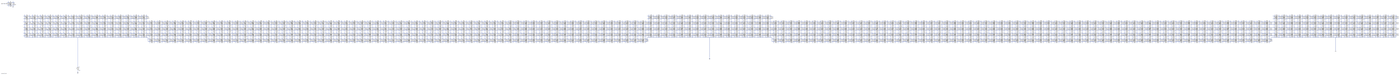
[diagram p0: schematic resistiveReactance.asc, whole sheet]
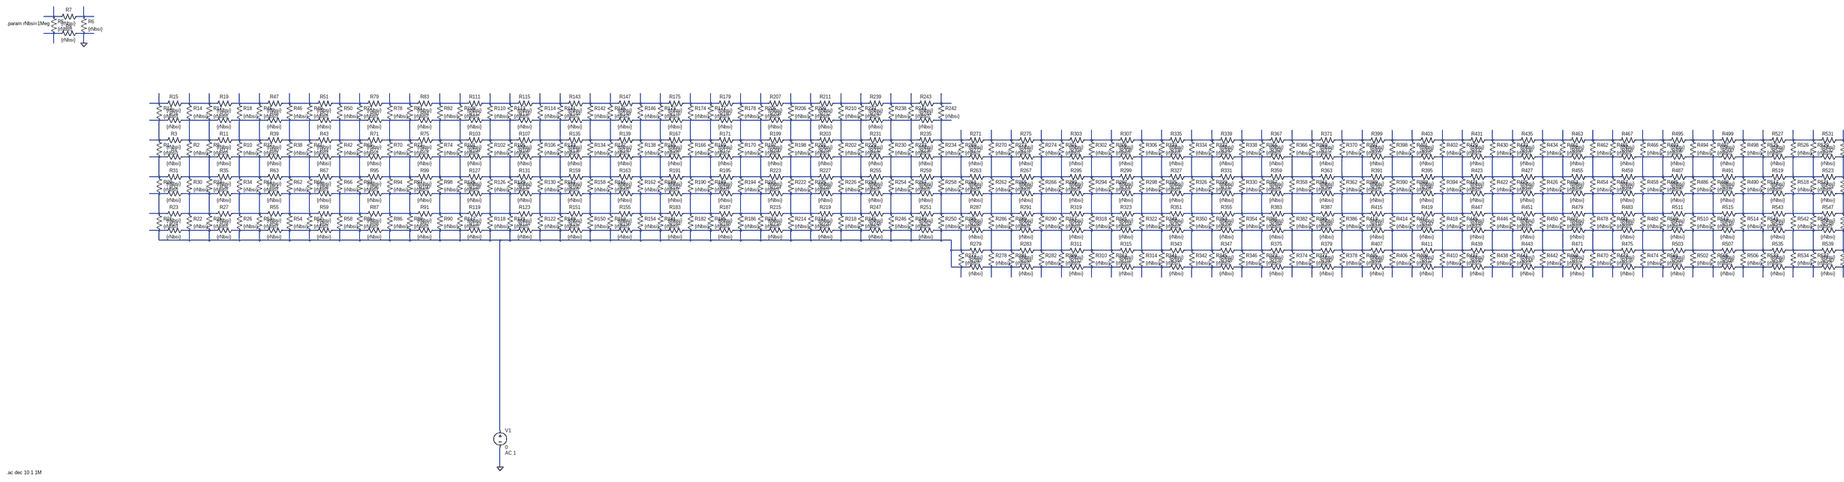
[diagram p1: schematic resistiveReactance.asc, part, row 1 of 1, column 1 of 5]
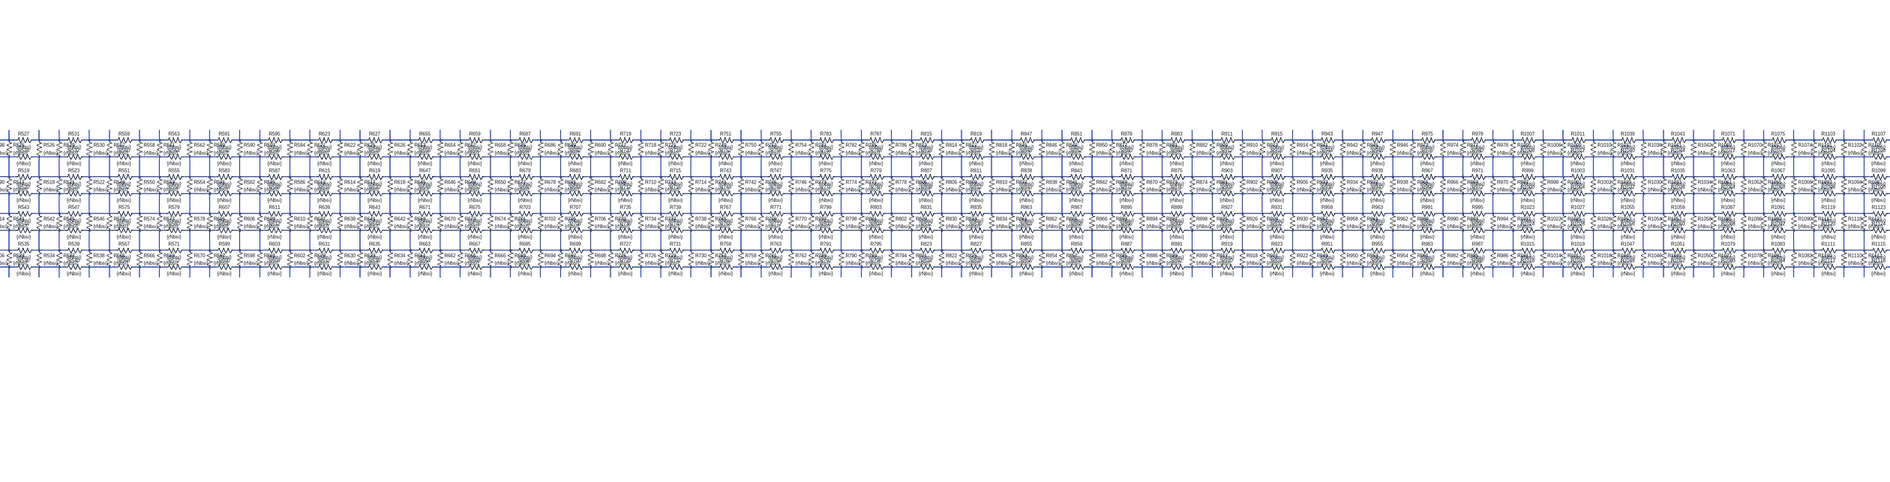
[diagram p2: schematic resistiveReactance.asc, part, row 1 of 1, column 2 of 5]
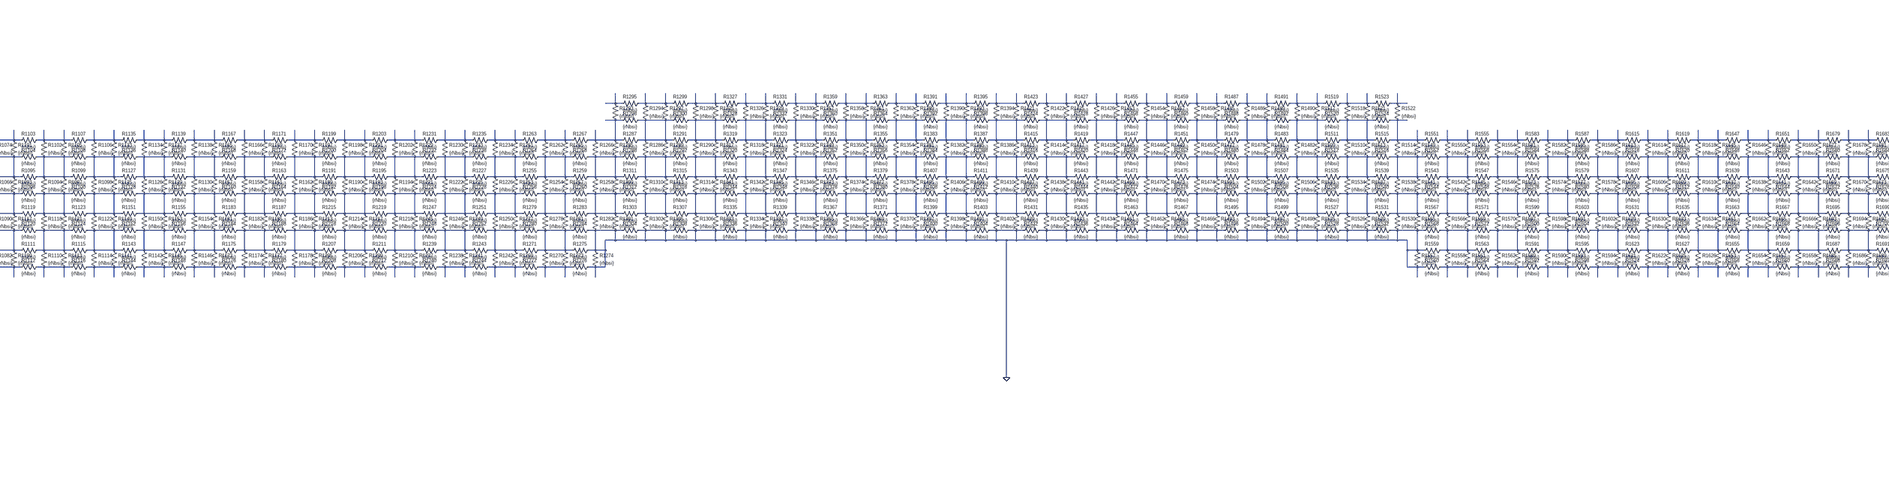
[diagram p3: schematic resistiveReactance.asc, part, row 1 of 1, column 3 of 5]
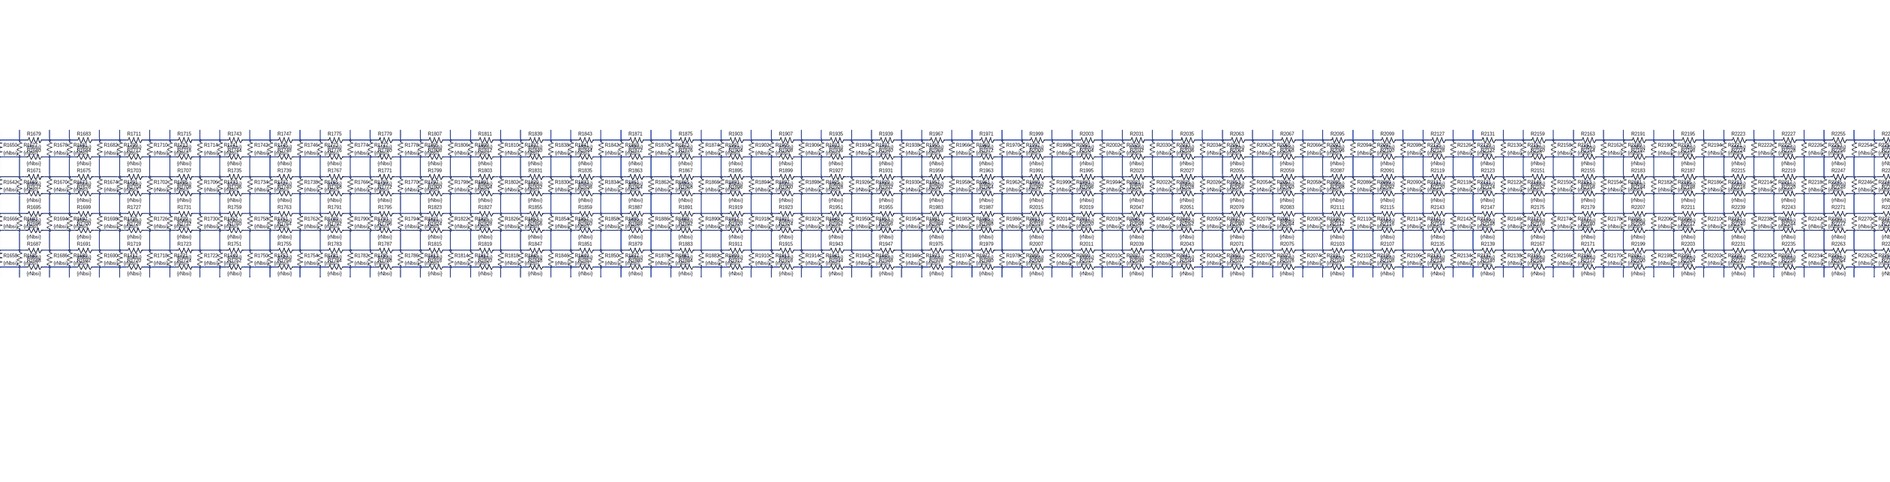
[diagram p4: schematic resistiveReactance.asc, part, row 1 of 1, column 4 of 5]
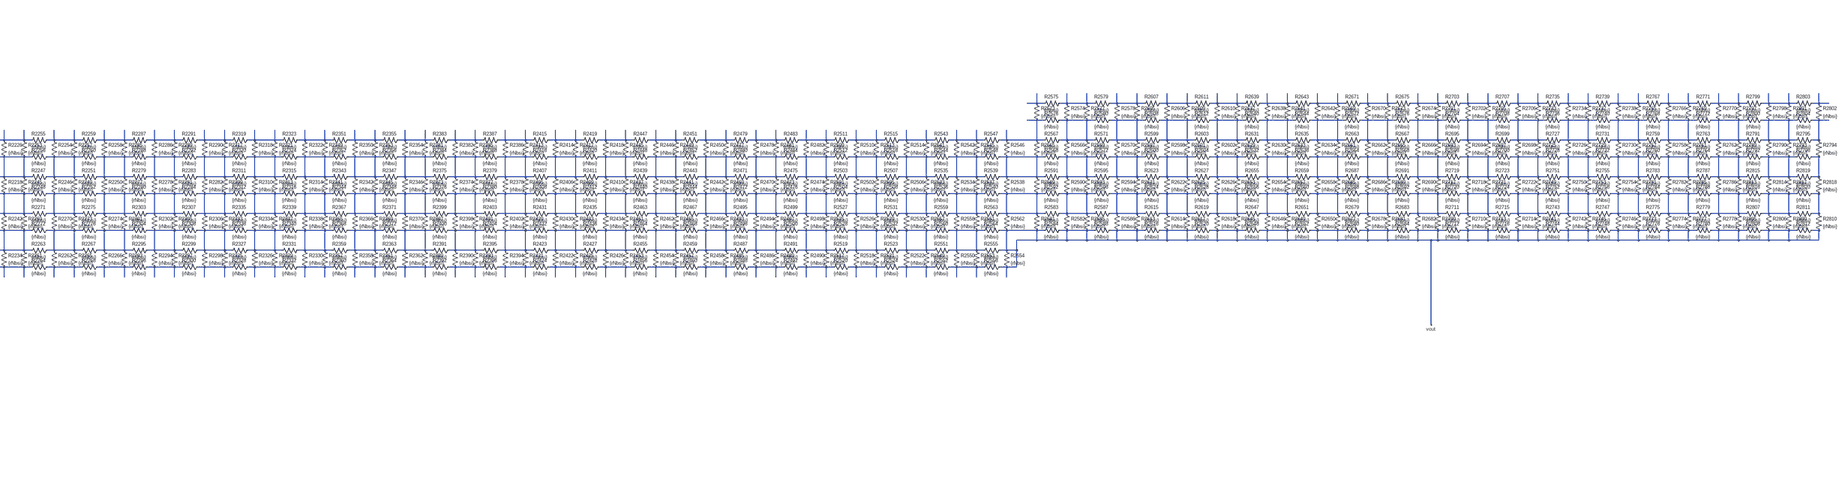
[diagram p5: schematic resistiveReactance.asc, part, row 1 of 1, column 5 of 5]
* resistiveReactance.asc
R5 N001 N003 {rNbsi}
R6 N002 0 {rNbsi}
R7 N002 N001 {rNbsi}
R8 0 N003 {rNbsi}
R1 N055 N232 {rNbsi}
R2 N056 N233 {rNbsi}
R3 N056 N055 {rNbsi}
R4 N233 N232 {rNbsi}
R9 N056 N233 {rNbsi}
R10 N057 N234 {rNbsi}
R11 N057 N056 {rNbsi}
R12 N234 N233 {rNbsi}
R13 N004 N055 {rNbsi}
R14 N005 N056 {rNbsi}
R15 N005 N004 {rNbsi}
R16 N056 N055 {rNbsi}
R17 N005 N056 {rNbsi}
R18 N006 N057 {rNbsi}
R19 N006 N005 {rNbsi}
R20 N057 N056 {rNbsi}
R21 N409 N586 {rNbsi}
R22 N410 N586 {rNbsi}
R23 N410 N409 {rNbsi}
R24 N586 N586 {rNbsi}
R25 N410 N586 {rNbsi}
R26 N411 N586 {rNbsi}
R27 N411 N410 {rNbsi}
R28 N586 N586 {rNbsi}
R29 N232 N409 {rNbsi}
R30 N233 N410 {rNbsi}
R31 N233 N232 {rNbsi}
R32 N410 N409 {rNbsi}
R33 N233 N410 {rNbsi}
R34 N234 N411 {rNbsi}
R35 N234 N233 {rNbsi}
R36 N411 N410 {rNbsi}
R37 N057 N234 {rNbsi}
R38 N058 N235 {rNbsi}
R39 N058 N057 {rNbsi}
R40 N235 N234 {rNbsi}
R41 N058 N235 {rNbsi}
R42 N059 N236 {rNbsi}
R43 N059 N058 {rNbsi}
R44 N236 N235 {rNbsi}
R45 N006 N057 {rNbsi}
R46 N007 N058 {rNbsi}
R47 N007 N006 {rNbsi}
R48 N058 N057 {rNbsi}
R49 N007 N058 {rNbsi}
R50 N008 N059 {rNbsi}
R51 N008 N007 {rNbsi}
R52 N059 N058 {rNbsi}
R53 N411 N586 {rNbsi}
R54 N412 N586 {rNbsi}
R55 N412 N411 {rNbsi}
R56 N586 N586 {rNbsi}
R57 N412 N586 {rNbsi}
R58 N413 N586 {rNbsi}
R59 N413 N412 {rNbsi}
R60 N586 N586 {rNbsi}
R61 N234 N411 {rNbsi}
R62 N235 N412 {rNbsi}
R63 N235 N234 {rNbsi}
R64 N412 N411 {rNbsi}
R65 N235 N412 {rNbsi}
R66 N236 N413 {rNbsi}
R67 N236 N235 {rNbsi}
R68 N413 N412 {rNbsi}
R69 N059 N236 {rNbsi}
R70 N060 N237 {rNbsi}
R71 N060 N059 {rNbsi}
R72 N237 N236 {rNbsi}
R73 N060 N237 {rNbsi}
R74 N061 N238 {rNbsi}
R75 N061 N060 {rNbsi}
R76 N238 N237 {rNbsi}
R77 N008 N059 {rNbsi}
R78 N009 N060 {rNbsi}
R79 N009 N008 {rNbsi}
R80 N060 N059 {rNbsi}
R81 N009 N060 {rNbsi}
R82 N010 N061 {rNbsi}
R83 N010 N009 {rNbsi}
R84 N061 N060 {rNbsi}
R85 N413 N586 {rNbsi}
R86 N414 N586 {rNbsi}
R87 N414 N413 {rNbsi}
R88 N586 N586 {rNbsi}
R89 N414 N586 {rNbsi}
R90 N415 N586 {rNbsi}
R91 N415 N414 {rNbsi}
R92 N586 N586 {rNbsi}
R93 N236 N413 {rNbsi}
R94 N237 N414 {rNbsi}
R95 N237 N236 {rNbsi}
R96 N414 N413 {rNbsi}
R97 N237 N414 {rNbsi}
R98 N238 N415 {rNbsi}
R99 N238 N237 {rNbsi}
R100 N415 N414 {rNbsi}
R101 N061 N238 {rNbsi}
R102 N062 N239 {rNbsi}
R103 N062 N061 {rNbsi}
R104 N239 N238 {rNbsi}
R105 N062 N239 {rNbsi}
R106 N063 N240 {rNbsi}
R107 N063 N062 {rNbsi}
R108 N240 N239 {rNbsi}
R109 N010 N061 {rNbsi}
R110 N011 N062 {rNbsi}
R111 N011 N010 {rNbsi}
R112 N062 N061 {rNbsi}
R113 N011 N062 {rNbsi}
R114 N012 N063 {rNbsi}
R115 N012 N011 {rNbsi}
R116 N063 N062 {rNbsi}
R117 N415 N586 {rNbsi}
R118 N416 N586 {rNbsi}
R119 N416 N415 {rNbsi}
R120 N586 N586 {rNbsi}
R121 N416 N586 {rNbsi}
R122 N417 N586 {rNbsi}
R123 N417 N416 {rNbsi}
R124 N586 N586 {rNbsi}
R125 N238 N415 {rNbsi}
R126 N239 N416 {rNbsi}
R127 N239 N238 {rNbsi}
R128 N416 N415 {rNbsi}
R129 N239 N416 {rNbsi}
R130 N240 N417 {rNbsi}
R131 N240 N239 {rNbsi}
R132 N417 N416 {rNbsi}
R133 N063 N240 {rNbsi}
R134 N064 N241 {rNbsi}
R135 N064 N063 {rNbsi}
R136 N241 N240 {rNbsi}
R137 N064 N241 {rNbsi}
R138 N065 N242 {rNbsi}
R139 N065 N064 {rNbsi}
R140 N242 N241 {rNbsi}
R141 N012 N063 {rNbsi}
R142 N013 N064 {rNbsi}
R143 N013 N012 {rNbsi}
R144 N064 N063 {rNbsi}
R145 N013 N064 {rNbsi}
R146 N014 N065 {rNbsi}
R147 N014 N013 {rNbsi}
R148 N065 N064 {rNbsi}
R149 N417 N586 {rNbsi}
R150 N418 N586 {rNbsi}
R151 N418 N417 {rNbsi}
R152 N586 N586 {rNbsi}
R153 N418 N586 {rNbsi}
R154 N419 N586 {rNbsi}
R155 N419 N418 {rNbsi}
R156 N586 N586 {rNbsi}
R157 N240 N417 {rNbsi}
R158 N241 N418 {rNbsi}
R159 N241 N240 {rNbsi}
R160 N418 N417 {rNbsi}
R161 N241 N418 {rNbsi}
R162 N242 N419 {rNbsi}
R163 N242 N241 {rNbsi}
R164 N419 N418 {rNbsi}
R165 N065 N242 {rNbsi}
R166 N066 N243 {rNbsi}
R167 N066 N065 {rNbsi}
R168 N243 N242 {rNbsi}
R169 N066 N243 {rNbsi}
R170 N067 N244 {rNbsi}
R171 N067 N066 {rNbsi}
R172 N244 N243 {rNbsi}
R173 N014 N065 {rNbsi}
R174 N015 N066 {rNbsi}
R175 N015 N014 {rNbsi}
R176 N066 N065 {rNbsi}
R177 N015 N066 {rNbsi}
R178 N016 N067 {rNbsi}
R179 N016 N015 {rNbsi}
R180 N067 N066 {rNbsi}
R181 N419 N586 {rNbsi}
R182 N420 N586 {rNbsi}
R183 N420 N419 {rNbsi}
R184 N586 N586 {rNbsi}
R185 N420 N586 {rNbsi}
R186 N421 N586 {rNbsi}
R187 N421 N420 {rNbsi}
R188 N586 N586 {rNbsi}
R189 N242 N419 {rNbsi}
R190 N243 N420 {rNbsi}
R191 N243 N242 {rNbsi}
R192 N420 N419 {rNbsi}
R193 N243 N420 {rNbsi}
R194 N244 N421 {rNbsi}
R195 N244 N243 {rNbsi}
R196 N421 N420 {rNbsi}
R197 N067 N244 {rNbsi}
R198 N068 N245 {rNbsi}
R199 N068 N067 {rNbsi}
R200 N245 N244 {rNbsi}
R201 N068 N245 {rNbsi}
R202 N069 N246 {rNbsi}
R203 N069 N068 {rNbsi}
R204 N246 N245 {rNbsi}
R205 N016 N067 {rNbsi}
R206 N017 N068 {rNbsi}
R207 N017 N016 {rNbsi}
R208 N068 N067 {rNbsi}
R209 N017 N068 {rNbsi}
R210 N018 N069 {rNbsi}
R211 N018 N017 {rNbsi}
R212 N069 N068 {rNbsi}
R213 N421 N586 {rNbsi}
R214 N422 N586 {rNbsi}
R215 N422 N421 {rNbsi}
R216 N586 N586 {rNbsi}
R217 N422 N586 {rNbsi}
R218 N423 N586 {rNbsi}
R219 N423 N422 {rNbsi}
R220 N586 N586 {rNbsi}
R221 N244 N421 {rNbsi}
R222 N245 N422 {rNbsi}
R223 N245 N244 {rNbsi}
R224 N422 N421 {rNbsi}
R225 N245 N422 {rNbsi}
R226 N246 N423 {rNbsi}
R227 N246 N245 {rNbsi}
R228 N423 N422 {rNbsi}
R229 N069 N246 {rNbsi}
R230 N070 N247 {rNbsi}
R231 N070 N069 {rNbsi}
R232 N247 N246 {rNbsi}
R233 N070 N247 {rNbsi}
R234 N071 N248 {rNbsi}
R235 N071 N070 {rNbsi}
R236 N248 N247 {rNbsi}
R237 N018 N069 {rNbsi}
R238 N019 N070 {rNbsi}
R239 N019 N018 {rNbsi}
R240 N070 N069 {rNbsi}
R241 N019 N070 {rNbsi}
R242 N020 N071 {rNbsi}
R243 N020 N019 {rNbsi}
R244 N071 N070 {rNbsi}
R245 N423 N586 {rNbsi}
R246 N424 N586 {rNbsi}
R247 N424 N423 {rNbsi}
R248 N586 N586 {rNbsi}
R249 N424 N586 {rNbsi}
R250 N425 N586 {rNbsi}
R251 N425 N424 {rNbsi}
R252 N586 N586 {rNbsi}
R253 N246 N423 {rNbsi}
R254 N247 N424 {rNbsi}
R255 N247 N246 {rNbsi}
R256 N424 N423 {rNbsi}
R257 N247 N424 {rNbsi}
R258 N248 N425 {rNbsi}
R259 N248 N247 {rNbsi}
R260 N425 N424 {rNbsi}
R261 N248 N425 {rNbsi}
R262 N249 N426 {rNbsi}
R263 N249 N248 {rNbsi}
R264 N426 N425 {rNbsi}
R265 N249 N426 {rNbsi}
R266 N250 N427 {rNbsi}
R267 N250 N249 {rNbsi}
R268 N427 N426 {rNbsi}
R269 N071 N248 {rNbsi}
R270 N106 N249 {rNbsi}
R271 N106 N071 {rNbsi}
R272 N249 N248 {rNbsi}
R273 N106 N249 {rNbsi}
R274 N107 N250 {rNbsi}
R275 N107 N106 {rNbsi}
R276 N250 N249 {rNbsi}
R277 N586 N586 {rNbsi}
R278 N587 N713 {rNbsi}
R279 N587 N586 {rNbsi}
R280 N713 N586 {rNbsi}
R281 N587 N713 {rNbsi}
R282 N588 N714 {rNbsi}
R283 N588 N587 {rNbsi}
R284 N714 N713 {rNbsi}
R285 N425 N586 {rNbsi}
R286 N426 N587 {rNbsi}
R287 N426 N425 {rNbsi}
R288 N587 N586 {rNbsi}
R289 N426 N587 {rNbsi}
R290 N427 N588 {rNbsi}
R291 N427 N426 {rNbsi}
R292 N588 N587 {rNbsi}
R293 N250 N427 {rNbsi}
R294 N251 N428 {rNbsi}
R295 N251 N250 {rNbsi}
R296 N428 N427 {rNbsi}
R297 N251 N428 {rNbsi}
R298 N252 N429 {rNbsi}
R299 N252 N251 {rNbsi}
R300 N429 N428 {rNbsi}
R301 N107 N250 {rNbsi}
R302 N108 N251 {rNbsi}
R303 N108 N107 {rNbsi}
R304 N251 N250 {rNbsi}
R305 N108 N251 {rNbsi}
R306 N109 N252 {rNbsi}
R307 N109 N108 {rNbsi}
R308 N252 N251 {rNbsi}
R309 N588 N714 {rNbsi}
R310 N589 N715 {rNbsi}
R311 N589 N588 {rNbsi}
R312 N715 N714 {rNbsi}
R313 N589 N715 {rNbsi}
R314 N590 N716 {rNbsi}
R315 N590 N589 {rNbsi}
R316 N716 N715 {rNbsi}
R317 N427 N588 {rNbsi}
R318 N428 N589 {rNbsi}
R319 N428 N427 {rNbsi}
R320 N589 N588 {rNbsi}
R321 N428 N589 {rNbsi}
R322 N429 N590 {rNbsi}
R323 N429 N428 {rNbsi}
R324 N590 N589 {rNbsi}
R325 N252 N429 {rNbsi}
R326 N253 N430 {rNbsi}
R327 N253 N252 {rNbsi}
R328 N430 N429 {rNbsi}
R329 N253 N430 {rNbsi}
R330 N254 N431 {rNbsi}
R331 N254 N253 {rNbsi}
R332 N431 N430 {rNbsi}
R333 N109 N252 {rNbsi}
R334 N110 N253 {rNbsi}
R335 N110 N109 {rNbsi}
R336 N253 N252 {rNbsi}
R337 N110 N253 {rNbsi}
R338 N111 N254 {rNbsi}
R339 N111 N110 {rNbsi}
R340 N254 N253 {rNbsi}
R341 N590 N716 {rNbsi}
R342 N591 N717 {rNbsi}
R343 N591 N590 {rNbsi}
R344 N717 N716 {rNbsi}
R345 N591 N717 {rNbsi}
R346 N592 N718 {rNbsi}
R347 N592 N591 {rNbsi}
R348 N718 N717 {rNbsi}
R349 N429 N590 {rNbsi}
R350 N430 N591 {rNbsi}
R351 N430 N429 {rNbsi}
R352 N591 N590 {rNbsi}
R353 N430 N591 {rNbsi}
R354 N431 N592 {rNbsi}
R355 N431 N430 {rNbsi}
R356 N592 N591 {rNbsi}
R357 N254 N431 {rNbsi}
R358 N255 N432 {rNbsi}
R359 N255 N254 {rNbsi}
R360 N432 N431 {rNbsi}
R361 N255 N432 {rNbsi}
R362 N256 N433 {rNbsi}
R363 N256 N255 {rNbsi}
R364 N433 N432 {rNbsi}
R365 N111 N254 {rNbsi}
R366 N112 N255 {rNbsi}
R367 N112 N111 {rNbsi}
R368 N255 N254 {rNbsi}
R369 N112 N255 {rNbsi}
R370 N113 N256 {rNbsi}
R371 N113 N112 {rNbsi}
R372 N256 N255 {rNbsi}
R373 N592 N718 {rNbsi}
R374 N593 N719 {rNbsi}
R375 N593 N592 {rNbsi}
R376 N719 N718 {rNbsi}
R377 N593 N719 {rNbsi}
R378 N594 N720 {rNbsi}
R379 N594 N593 {rNbsi}
R380 N720 N719 {rNbsi}
R381 N431 N592 {rNbsi}
R382 N432 N593 {rNbsi}
R383 N432 N431 {rNbsi}
R384 N593 N592 {rNbsi}
R385 N432 N593 {rNbsi}
R386 N433 N594 {rNbsi}
R387 N433 N432 {rNbsi}
R388 N594 N593 {rNbsi}
R389 N256 N433 {rNbsi}
R390 N257 N434 {rNbsi}
R391 N257 N256 {rNbsi}
R392 N434 N433 {rNbsi}
R393 N257 N434 {rNbsi}
R394 N258 N435 {rNbsi}
R395 N258 N257 {rNbsi}
R396 N435 N434 {rNbsi}
R397 N113 N256 {rNbsi}
R398 N114 N257 {rNbsi}
R399 N114 N113 {rNbsi}
R400 N257 N256 {rNbsi}
R401 N114 N257 {rNbsi}
R402 N115 N258 {rNbsi}
R403 N115 N114 {rNbsi}
R404 N258 N257 {rNbsi}
R405 N594 N720 {rNbsi}
R406 N595 N721 {rNbsi}
R407 N595 N594 {rNbsi}
R408 N721 N720 {rNbsi}
R409 N595 N721 {rNbsi}
R410 N596 N722 {rNbsi}
R411 N596 N595 {rNbsi}
R412 N722 N721 {rNbsi}
R413 N433 N594 {rNbsi}
R414 N434 N595 {rNbsi}
R415 N434 N433 {rNbsi}
R416 N595 N594 {rNbsi}
R417 N434 N595 {rNbsi}
R418 N435 N596 {rNbsi}
R419 N435 N434 {rNbsi}
R420 N596 N595 {rNbsi}
R421 N258 N435 {rNbsi}
R422 N259 N436 {rNbsi}
R423 N259 N258 {rNbsi}
R424 N436 N435 {rNbsi}
R425 N259 N436 {rNbsi}
R426 N260 N437 {rNbsi}
R427 N260 N259 {rNbsi}
R428 N437 N436 {rNbsi}
R429 N115 N258 {rNbsi}
R430 N116 N259 {rNbsi}
R431 N116 N115 {rNbsi}
R432 N259 N258 {rNbsi}
R433 N116 N259 {rNbsi}
R434 N117 N260 {rNbsi}
R435 N117 N116 {rNbsi}
R436 N260 N259 {rNbsi}
R437 N596 N722 {rNbsi}
R438 N597 N723 {rNbsi}
R439 N597 N596 {rNbsi}
R440 N723 N722 {rNbsi}
R441 N597 N723 {rNbsi}
R442 N598 N724 {rNbsi}
R443 N598 N597 {rNbsi}
R444 N724 N723 {rNbsi}
R445 N435 N596 {rNbsi}
R446 N436 N597 {rNbsi}
R447 N436 N435 {rNbsi}
R448 N597 N596 {rNbsi}
R449 N436 N597 {rNbsi}
R450 N437 N598 {rNbsi}
R451 N437 N436 {rNbsi}
R452 N598 N597 {rNbsi}
R453 N260 N437 {rNbsi}
R454 N261 N438 {rNbsi}
R455 N261 N260 {rNbsi}
R456 N438 N437 {rNbsi}
R457 N261 N438 {rNbsi}
R458 N262 N439 {rNbsi}
R459 N262 N261 {rNbsi}
R460 N439 N438 {rNbsi}
R461 N117 N260 {rNbsi}
R462 N118 N261 {rNbsi}
R463 N118 N117 {rNbsi}
R464 N261 N260 {rNbsi}
R465 N118 N261 {rNbsi}
R466 N119 N262 {rNbsi}
R467 N119 N118 {rNbsi}
R468 N262 N261 {rNbsi}
R469 N598 N724 {rNbsi}
R470 N599 N725 {rNbsi}
R471 N599 N598 {rNbsi}
R472 N725 N724 {rNbsi}
R473 N599 N725 {rNbsi}
R474 N600 N726 {rNbsi}
R475 N600 N599 {rNbsi}
R476 N726 N725 {rNbsi}
R477 N437 N598 {rNbsi}
R478 N438 N599 {rNbsi}
R479 N438 N437 {rNbsi}
R480 N599 N598 {rNbsi}
R481 N438 N599 {rNbsi}
R482 N439 N600 {rNbsi}
R483 N439 N438 {rNbsi}
R484 N600 N599 {rNbsi}
R485 N262 N439 {rNbsi}
R486 N263 N440 {rNbsi}
R487 N263 N262 {rNbsi}
R488 N440 N439 {rNbsi}
R489 N263 N440 {rNbsi}
R490 N264 N441 {rNbsi}
R491 N264 N263 {rNbsi}
R492 N441 N440 {rNbsi}
R493 N119 N262 {rNbsi}
R494 N120 N263 {rNbsi}
R495 N120 N119 {rNbsi}
R496 N263 N262 {rNbsi}
R497 N120 N263 {rNbsi}
R498 N121 N264 {rNbsi}
R499 N121 N120 {rNbsi}
R500 N264 N263 {rNbsi}
R501 N600 N726 {rNbsi}
R502 N601 N727 {rNbsi}
R503 N601 N600 {rNbsi}
R504 N727 N726 {rNbsi}
R505 N601 N727 {rNbsi}
R506 N602 N728 {rNbsi}
R507 N602 N601 {rNbsi}
R508 N728 N727 {rNbsi}
R509 N439 N600 {rNbsi}
R510 N440 N601 {rNbsi}
R511 N440 N439 {rNbsi}
R512 N601 N600 {rNbsi}
R513 N440 N601 {rNbsi}
R514 N441 N602 {rNbsi}
R515 N441 N440 {rNbsi}
R516 N602 N601 {rNbsi}
R517 N264 N441 {rNbsi}
R518 N265 N442 {rNbsi}
R519 N265 N264 {rNbsi}
R520 N442 N441 {rNbsi}
R521 N265 N442 {rNbsi}
R522 N266 N443 {rNbsi}
R523 N266 N265 {rNbsi}
R524 N443 N442 {rNbsi}
R525 N121 N264 {rNbsi}
R526 N122 N265 {rNbsi}
R527 N122 N121 {rNbsi}
R528 N265 N264 {rNbsi}
R529 N122 N265 {rNbsi}
R530 N123 N266 {rNbsi}
R531 N123 N122 {rNbsi}
R532 N266 N265 {rNbsi}
R533 N602 N728 {rNbsi}
R534 N603 N729 {rNbsi}
R535 N603 N602 {rNbsi}
R536 N729 N728 {rNbsi}
R537 N603 N729 {rNbsi}
R538 N604 N730 {rNbsi}
R539 N604 N603 {rNbsi}
R540 N730 N729 {rNbsi}
R541 N441 N602 {rNbsi}
R542 N442 N603 {rNbsi}
R543 N442 N441 {rNbsi}
R544 N603 N602 {rNbsi}
R545 N442 N603 {rNbsi}
R546 N443 N604 {rNbsi}
R547 N443 N442 {rNbsi}
R548 N604 N603 {rNbsi}
R549 N266 N443 {rNbsi}
R550 N267 N444 {rNbsi}
R551 N267 N266 {rNbsi}
R552 N444 N443 {rNbsi}
R553 N267 N444 {rNbsi}
R554 N268 N445 {rNbsi}
R555 N268 N267 {rNbsi}
R556 N445 N444 {rNbsi}
R557 N123 N266 {rNbsi}
R558 N124 N267 {rNbsi}
R559 N124 N123 {rNbsi}
R560 N267 N266 {rNbsi}
R561 N124 N267 {rNbsi}
R562 N125 N268 {rNbsi}
R563 N125 N124 {rNbsi}
R564 N268 N267 {rNbsi}
R565 N604 N730 {rNbsi}
R566 N605 N731 {rNbsi}
R567 N605 N604 {rNbsi}
R568 N731 N730 {rNbsi}
R569 N605 N731 {rNbsi}
R570 N606 N732 {rNbsi}
R571 N606 N605 {rNbsi}
R572 N732 N731 {rNbsi}
R573 N443 N604 {rNbsi}
R574 N444 N605 {rNbsi}
R575 N444 N443 {rNbsi}
R576 N605 N604 {rNbsi}
R577 N444 N605 {rNbsi}
R578 N445 N606 {rNbsi}
R579 N445 N444 {rNbsi}
R580 N606 N605 {rNbsi}
R581 N268 N445 {rNbsi}
R582 N269 N446 {rNbsi}
R583 N269 N268 {rNbsi}
R584 N446 N445 {rNbsi}
R585 N269 N446 {rNbsi}
R586 N270 N447 {rNbsi}
R587 N270 N269 {rNbsi}
R588 N447 N446 {rNbsi}
R589 N125 N268 {rNbsi}
R590 N126 N269 {rNbsi}
R591 N126 N125 {rNbsi}
R592 N269 N268 {rNbsi}
R593 N126 N269 {rNbsi}
R594 N127 N270 {rNbsi}
R595 N127 N126 {rNbsi}
R596 N270 N269 {rNbsi}
R597 N606 N732 {rNbsi}
R598 N607 N733 {rNbsi}
R599 N607 N606 {rNbsi}
R600 N733 N732 {rNbsi}
R601 N607 N733 {rNbsi}
R602 N608 N734 {rNbsi}
R603 N608 N607 {rNbsi}
R604 N734 N733 {rNbsi}
R605 N445 N606 {rNbsi}
R606 N446 N607 {rNbsi}
R607 N446 N445 {rNbsi}
R608 N607 N606 {rNbsi}
R609 N446 N607 {rNbsi}
R610 N447 N608 {rNbsi}
R611 N447 N446 {rNbsi}
R612 N608 N607 {rNbsi}
R613 N270 N447 {rNbsi}
R614 N271 N448 {rNbsi}
R615 N271 N270 {rNbsi}
R616 N448 N447 {rNbsi}
R617 N271 N448 {rNbsi}
R618 N272 N449 {rNbsi}
R619 N272 N271 {rNbsi}
R620 N449 N448 {rNbsi}
R621 N127 N270 {rNbsi}
R622 N128 N271 {rNbsi}
R623 N128 N127 {rNbsi}
R624 N271 N270 {rNbsi}
R625 N128 N271 {rNbsi}
R626 N129 N272 {rNbsi}
R627 N129 N128 {rNbsi}
R628 N272 N271 {rNbsi}
R629 N608 N734 {rNbsi}
R630 N609 N735 {rNbsi}
R631 N609 N608 {rNbsi}
R632 N735 N734 {rNbsi}
R633 N609 N735 {rNbsi}
R634 N610 N736 {rNbsi}
R635 N610 N609 {rNbsi}
R636 N736 N735 {rNbsi}
R637 N447 N608 {rNbsi}
R638 N448 N609 {rNbsi}
R639 N448 N447 {rNbsi}
R640 N609 N608 {rNbsi}
R641 N448 N609 {rNbsi}
R642 N449 N610 {rNbsi}
R643 N449 N448 {rNbsi}
R644 N610 N609 {rNbsi}
R645 N272 N449 {rNbsi}
R646 N273 N450 {rNbsi}
R647 N273 N272 {rNbsi}
R648 N450 N449 {rNbsi}
R649 N273 N450 {rNbsi}
R650 N274 N451 {rNbsi}
R651 N274 N273 {rNbsi}
R652 N451 N450 {rNbsi}
R653 N129 N272 {rNbsi}
R654 N130 N273 {rNbsi}
R655 N130 N129 {rNbsi}
R656 N273 N272 {rNbsi}
R657 N130 N273 {rNbsi}
R658 N131 N274 {rNbsi}
R659 N131 N130 {rNbsi}
R660 N274 N273 {rNbsi}
R661 N610 N736 {rNbsi}
R662 N611 N737 {rNbsi}
R663 N611 N610 {rNbsi}
R664 N737 N736 {rNbsi}
R665 N611 N737 {rNbsi}
R666 N612 N738 {rNbsi}
R667 N612 N611 {rNbsi}
R668 N738 N737 {rNbsi}
R669 N449 N610 {rNbsi}
R670 N450 N611 {rNbsi}
R671 N450 N449 {rNbsi}
R672 N611 N610 {rNbsi}
R673 N450 N611 {rNbsi}
R674 N451 N612 {rNbsi}
R675 N451 N450 {rNbsi}
R676 N612 N611 {rNbsi}
R677 N274 N451 {rNbsi}
R678 N275 N452 {rNbsi}
R679 N275 N274 {rNbsi}
R680 N452 N451 {rNbsi}
R681 N275 N452 {rNbsi}
R682 N276 N453 {rNbsi}
R683 N276 N275 {rNbsi}
R684 N453 N452 {rNbsi}
R685 N131 N274 {rNbsi}
R686 N132 N275 {rNbsi}
R687 N132 N131 {rNbsi}
R688 N275 N274 {rNbsi}
R689 N132 N275 {rNbsi}
R690 N133 N276 {rNbsi}
R691 N133 N132 {rNbsi}
R692 N276 N275 {rNbsi}
R693 N612 N738 {rNbsi}
R694 N613 N739 {rNbsi}
R695 N613 N612 {rNbsi}
R696 N739 N738 {rNbsi}
R697 N613 N739 {rNbsi}
R698 N614 N740 {rNbsi}
R699 N614 N613 {rNbsi}
R700 N740 N739 {rNbsi}
R701 N451 N612 {rNbsi}
R702 N452 N613 {rNbsi}
R703 N452 N451 {rNbsi}
R704 N613 N612 {rNbsi}
R705 N452 N613 {rNbsi}
R706 N453 N614 {rNbsi}
R707 N453 N452 {rNbsi}
R708 N614 N613 {rNbsi}
R709 N276 N453 {rNbsi}
R710 N277 N454 {rNbsi}
R711 N277 N276 {rNbsi}
R712 N454 N453 {rNbsi}
R713 N277 N454 {rNbsi}
R714 N278 N455 {rNbsi}
R715 N278 N277 {rNbsi}
R716 N455 N454 {rNbsi}
R717 N133 N276 {rNbsi}
R718 N134 N277 {rNbsi}
R719 N134 N133 {rNbsi}
R720 N277 N276 {rNbsi}
R721 N134 N277 {rNbsi}
R722 N135 N278 {rNbsi}
R723 N135 N134 {rNbsi}
R724 N278 N277 {rNbsi}
R725 N614 N740 {rNbsi}
R726 N615 N741 {rNbsi}
R727 N615 N614 {rNbsi}
R728 N741 N740 {rNbsi}
R729 N615 N741 {rNbsi}
R730 N616 N742 {rNbsi}
R731 N616 N615 {rNbsi}
R732 N742 N741 {rNbsi}
R733 N453 N614 {rNbsi}
R734 N454 N615 {rNbsi}
R735 N454 N453 {rNbsi}
R736 N615 N614 {rNbsi}
R737 N454 N615 {rNbsi}
R738 N455 N616 {rNbsi}
R739 N455 N454 {rNbsi}
R740 N616 N615 {rNbsi}
R741 N278 N455 {rNbsi}
R742 N279 N456 {rNbsi}
R743 N279 N278 {rNbsi}
R744 N456 N455 {rNbsi}
R745 N279 N456 {rNbsi}
R746 N280 N457 {rNbsi}
R747 N280 N279 {rNbsi}
R748 N457 N456 {rNbsi}
R749 N135 N278 {rNbsi}
R750 N136 N279 {rNbsi}
R751 N136 N135 {rNbsi}
R752 N279 N278 {rNbsi}
R753 N136 N279 {rNbsi}
R754 N137 N280 {rNbsi}
R755 N137 N136 {rNbsi}
R756 N280 N279 {rNbsi}
R757 N616 N742 {rNbsi}
R758 N617 N743 {rNbsi}
R759 N617 N616 {rNbsi}
R760 N743 N742 {rNbsi}
R761 N617 N743 {rNbsi}
R762 N618 N744 {rNbsi}
R763 N618 N617 {rNbsi}
R764 N744 N743 {rNbsi}
R765 N455 N616 {rNbsi}
R766 N456 N617 {rNbsi}
R767 N456 N455 {rNbsi}
R768 N617 N616 {rNbsi}
R769 N456 N617 {rNbsi}
R770 N457 N618 {rNbsi}
R771 N457 N456 {rNbsi}
R772 N618 N617 {rNbsi}
R773 N280 N457 {rNbsi}
R774 N281 N458 {rNbsi}
R775 N281 N280 {rNbsi}
R776 N458 N457 {rNbsi}
R777 N281 N458 {rNbsi}
R778 N282 N459 {rNbsi}
R779 N282 N281 {rNbsi}
R780 N459 N458 {rNbsi}
R781 N137 N280 {rNbsi}
R782 N138 N281 {rNbsi}
R783 N138 N137 {rNbsi}
R784 N281 N280 {rNbsi}
R785 N138 N281 {rNbsi}
R786 N139 N282 {rNbsi}
R787 N139 N138 {rNbsi}
R788 N282 N281 {rNbsi}
R789 N618 N744 {rNbsi}
R790 N619 N745 {rNbsi}
R791 N619 N618 {rNbsi}
R792 N745 N744 {rNbsi}
R793 N619 N745 {rNbsi}
R794 N620 N746 {rNbsi}
R795 N620 N619 {rNbsi}
R796 N746 N745 {rNbsi}
R797 N457 N618 {rNbsi}
R798 N458 N619 {rNbsi}
R799 N458 N457 {rNbsi}
R800 N619 N618 {rNbsi}
R801 N458 N619 {rNbsi}
R802 N459 N620 {rNbsi}
R803 N459 N458 {rNbsi}
R804 N620 N619 {rNbsi}
R805 N282 N459 {rNbsi}
R806 N283 N460 {rNbsi}
R807 N283 N282 {rNbsi}
R808 N460 N459 {rNbsi}
R809 N283 N460 {rNbsi}
R810 N284 N461 {rNbsi}
R811 N284 N283 {rNbsi}
R812 N461 N460 {rNbsi}
R813 N139 N282 {rNbsi}
R814 N140 N283 {rNbsi}
R815 N140 N139 {rNbsi}
R816 N283 N282 {rNbsi}
R817 N140 N283 {rNbsi}
R818 N141 N284 {rNbsi}
R819 N141 N140 {rNbsi}
R820 N284 N283 {rNbsi}
R821 N620 N746 {rNbsi}
R822 N621 N747 {rNbsi}
R823 N621 N620 {rNbsi}
R824 N747 N746 {rNbsi}
R825 N621 N747 {rNbsi}
R826 N622 N748 {rNbsi}
R827 N622 N621 {rNbsi}
R828 N748 N747 {rNbsi}
R829 N459 N620 {rNbsi}
R830 N460 N621 {rNbsi}
R831 N460 N459 {rNbsi}
R832 N621 N620 {rNbsi}
R833 N460 N621 {rNbsi}
R834 N461 N622 {rNbsi}
R835 N461 N460 {rNbsi}
R836 N622 N621 {rNbsi}
R837 N284 N461 {rNbsi}
R838 N285 N462 {rNbsi}
R839 N285 N284 {rNbsi}
R840 N462 N461 {rNbsi}
R841 N285 N462 {rNbsi}
R842 N286 N463 {rNbsi}
R843 N286 N285 {rNbsi}
R844 N463 N462 {rNbsi}
R845 N141 N284 {rNbsi}
R846 N142 N285 {rNbsi}
R847 N142 N141 {rNbsi}
R848 N285 N284 {rNbsi}
R849 N142 N285 {rNbsi}
R850 N143 N286 {rNbsi}
R851 N143 N142 {rNbsi}
R852 N286 N285 {rNbsi}
R853 N622 N748 {rNbsi}
R854 N623 N749 {rNbsi}
R855 N623 N622 {rNbsi}
R856 N749 N748 {rNbsi}
R857 N623 N749 {rNbsi}
R858 N624 N750 {rNbsi}
R859 N624 N623 {rNbsi}
R860 N750 N749 {rNbsi}
R861 N461 N622 {rNbsi}
R862 N462 N623 {rNbsi}
R863 N462 N461 {rNbsi}
R864 N623 N622 {rNbsi}
R865 N462 N623 {rNbsi}
R866 N463 N624 {rNbsi}
R867 N463 N462 {rNbsi}
R868 N624 N623 {rNbsi}
R869 N286 N463 {rNbsi}
R870 N287 N464 {rNbsi}
R871 N287 N286 {rNbsi}
R872 N464 N463 {rNbsi}
R873 N287 N464 {rNbsi}
R874 N288 N465 {rNbsi}
R875 N288 N287 {rNbsi}
R876 N465 N464 {rNbsi}
R877 N143 N286 {rNbsi}
R878 N144 N287 {rNbsi}
R879 N144 N143 {rNbsi}
R880 N287 N286 {rNbsi}
R881 N144 N287 {rNbsi}
R882 N145 N288 {rNbsi}
R883 N145 N144 {rNbsi}
R884 N288 N287 {rNbsi}
R885 N624 N750 {rNbsi}
R886 N625 N751 {rNbsi}
R887 N625 N624 {rNbsi}
R888 N751 N750 {rNbsi}
R889 N625 N751 {rNbsi}
R890 N626 N752 {rNbsi}
R891 N626 N625 {rNbsi}
R892 N752 N751 {rNbsi}
R893 N463 N624 {rNbsi}
R894 N464 N625 {rNbsi}
R895 N464 N463 {rNbsi}
R896 N625 N624 {rNbsi}
R897 N464 N625 {rNbsi}
R898 N465 N626 {rNbsi}
R899 N465 N464 {rNbsi}
R900 N626 N625 {rNbsi}
R901 N288 N465 {rNbsi}
R902 N289 N466 {rNbsi}
R903 N289 N288 {rNbsi}
R904 N466 N465 {rNbsi}
R905 N289 N466 {rNbsi}
R906 N290 N467 {rNbsi}
R907 N290 N289 {rNbsi}
R908 N467 N466 {rNbsi}
R909 N145 N288 {rNbsi}
R910 N146 N289 {rNbsi}
R911 N146 N145 {rNbsi}
R912 N289 N288 {rNbsi}
R913 N146 N289 {rNbsi}
R914 N147 N290 {rNbsi}
R915 N147 N146 {rNbsi}
R916 N290 N289 {rNbsi}
R917 N626 N752 {rNbsi}
R918 N627 N753 {rNbsi}
R919 N627 N626 {rNbsi}
R920 N753 N752 {rNbsi}
R921 N627 N753 {rNbsi}
R922 N628 N754 {rNbsi}
R923 N628 N627 {rNbsi}
R924 N754 N753 {rNbsi}
R925 N465 N626 {rNbsi}
R926 N466 N627 {rNbsi}
R927 N466 N465 {rNbsi}
R928 N627 N626 {rNbsi}
R929 N466 N627 {rNbsi}
R930 N467 N628 {rNbsi}
R931 N467 N466 {rNbsi}
R932 N628 N627 {rNbsi}
R933 N290 N467 {rNbsi}
R934 N291 N468 {rNbsi}
R935 N291 N290 {rNbsi}
R936 N468 N467 {rNbsi}
R937 N291 N468 {rNbsi}
R938 N292 N469 {rNbsi}
R939 N292 N291 {rNbsi}
R940 N469 N468 {rNbsi}
R941 N147 N290 {rNbsi}
R942 N148 N291 {rNbsi}
R943 N148 N147 {rNbsi}
R944 N291 N290 {rNbsi}
R945 N148 N291 {rNbsi}
R946 N149 N292 {rNbsi}
R947 N149 N148 {rNbsi}
R948 N292 N291 {rNbsi}
R949 N628 N754 {rNbsi}
R950 N629 N755 {rNbsi}
R951 N629 N628 {rNbsi}
R952 N755 N754 {rNbsi}
R953 N629 N755 {rNbsi}
R954 N630 N756 {rNbsi}
R955 N630 N629 {rNbsi}
R956 N756 N755 {rNbsi}
R957 N467 N628 {rNbsi}
R958 N468 N629 {rNbsi}
R959 N468 N467 {rNbsi}
R960 N629 N628 {rNbsi}
R961 N468 N629 {rNbsi}
R962 N469 N630 {rNbsi}
R963 N469 N468 {rNbsi}
R964 N630 N629 {rNbsi}
R965 N292 N469 {rNbsi}
R966 N293 N470 {rNbsi}
R967 N293 N292 {rNbsi}
R968 N470 N469 {rNbsi}
R969 N293 N470 {rNbsi}
R970 N294 N471 {rNbsi}
R971 N294 N293 {rNbsi}
R972 N471 N470 {rNbsi}
R973 N149 N292 {rNbsi}
R974 N150 N293 {rNbsi}
R975 N150 N149 {rNbsi}
R976 N293 N292 {rNbsi}
R977 N150 N293 {rNbsi}
R978 N151 N294 {rNbsi}
R979 N151 N150 {rNbsi}
R980 N294 N293 {rNbsi}
R981 N630 N756 {rNbsi}
R982 N631 N757 {rNbsi}
R983 N631 N630 {rNbsi}
R984 N757 N756 {rNbsi}
R985 N631 N757 {rNbsi}
R986 N632 N758 {rNbsi}
R987 N632 N631 {rNbsi}
R988 N758 N757 {rNbsi}
R989 N469 N630 {rNbsi}
R990 N470 N631 {rNbsi}
R991 N470 N469 {rNbsi}
R992 N631 N630 {rNbsi}
R993 N470 N631 {rNbsi}
R994 N471 N632 {rNbsi}
R995 N471 N470 {rNbsi}
R996 N632 N631 {rNbsi}
R997 N294 N471 {rNbsi}
R998 N295 N472 {rNbsi}
R999 N295 N294 {rNbsi}
R1000 N472 N471 {rNbsi}
R1001 N295 N472 {rNbsi}
R1002 N296 N473 {rNbsi}
R1003 N296 N295 {rNbsi}
R1004 N473 N472 {rNbsi}
R1005 N151 N294 {rNbsi}
R1006 N152 N295 {rNbsi}
R1007 N152 N151 {rNbsi}
R1008 N295 N294 {rNbsi}
R1009 N152 N295 {rNbsi}
R1010 N153 N296 {rNbsi}
R1011 N153 N152 {rNbsi}
R1012 N296 N295 {rNbsi}
R1013 N632 N758 {rNbsi}
R1014 N633 N759 {rNbsi}
R1015 N633 N632 {rNbsi}
R1016 N759 N758 {rNbsi}
R1017 N633 N759 {rNbsi}
R1018 N634 N760 {rNbsi}
R1019 N634 N633 {rNbsi}
R1020 N760 N759 {rNbsi}
R1021 N471 N632 {rNbsi}
R1022 N472 N633 {rNbsi}
R1023 N472 N471 {rNbsi}
R1024 N633 N632 {rNbsi}
R1025 N472 N633 {rNbsi}
R1026 N473 N634 {rNbsi}
R1027 N473 N472 {rNbsi}
R1028 N634 N633 {rNbsi}
R1029 N296 N473 {rNbsi}
R1030 N297 N474 {rNbsi}
R1031 N297 N296 {rNbsi}
R1032 N474 N473 {rNbsi}
R1033 N297 N474 {rNbsi}
R1034 N298 N475 {rNbsi}
R1035 N298 N297 {rNbsi}
R1036 N475 N474 {rNbsi}
R1037 N153 N296 {rNbsi}
R1038 N154 N297 {rNbsi}
R1039 N154 N153 {rNbsi}
R1040 N297 N296 {rNbsi}
R1041 N154 N297 {rNbsi}
R1042 N155 N298 {rNbsi}
R1043 N155 N154 {rNbsi}
R1044 N298 N297 {rNbsi}
R1045 N634 N760 {rNbsi}
R1046 N635 N761 {rNbsi}
R1047 N635 N634 {rNbsi}
R1048 N761 N760 {rNbsi}
R1049 N635 N761 {rNbsi}
R1050 N636 N762 {rNbsi}
R1051 N636 N635 {rNbsi}
R1052 N762 N761 {rNbsi}
R1053 N473 N634 {rNbsi}
R1054 N474 N635 {rNbsi}
R1055 N474 N473 {rNbsi}
R1056 N635 N634 {rNbsi}
R1057 N474 N635 {rNbsi}
R1058 N475 N636 {rNbsi}
R1059 N475 N474 {rNbsi}
R1060 N636 N635 {rNbsi}
R1061 N298 N475 {rNbsi}
R1062 N299 N476 {rNbsi}
R1063 N299 N298 {rNbsi}
R1064 N476 N475 {rNbsi}
R1065 N299 N476 {rNbsi}
R1066 N300 N477 {rNbsi}
R1067 N300 N299 {rNbsi}
R1068 N477 N476 {rNbsi}
R1069 N155 N298 {rNbsi}
R1070 N156 N299 {rNbsi}
R1071 N156 N155 {rNbsi}
R1072 N299 N298 {rNbsi}
R1073 N156 N299 {rNbsi}
R1074 N157 N300 {rNbsi}
R1075 N157 N156 {rNbsi}
R1076 N300 N299 {rNbsi}
R1077 N636 N762 {rNbsi}
R1078 N637 N763 {rNbsi}
R1079 N637 N636 {rNbsi}
R1080 N763 N762 {rNbsi}
R1081 N637 N763 {rNbsi}
R1082 N638 N764 {rNbsi}
R1083 N638 N637 {rNbsi}
R1084 N764 N763 {rNbsi}
R1085 N475 N636 {rNbsi}
R1086 N476 N637 {rNbsi}
R1087 N476 N475 {rNbsi}
R1088 N637 N636 {rNbsi}
R1089 N476 N637 {rNbsi}
R1090 N477 N638 {rNbsi}
R1091 N477 N476 {rNbsi}
R1092 N638 N637 {rNbsi}
R1093 N300 N477 {rNbsi}
R1094 N301 N478 {rNbsi}
R1095 N301 N300 {rNbsi}
R1096 N478 N477 {rNbsi}
R1097 N301 N478 {rNbsi}
R1098 N302 N479 {rNbsi}
R1099 N302 N301 {rNbsi}
R1100 N479 N478 {rNbsi}
R1101 N157 N300 {rNbsi}
R1102 N158 N301 {rNbsi}
R1103 N158 N157 {rNbsi}
R1104 N301 N300 {rNbsi}
R1105 N158 N301 {rNbsi}
R1106 N159 N302 {rNbsi}
R1107 N159 N158 {rNbsi}
R1108 N302 N301 {rNbsi}
R1109 N638 N764 {rNbsi}
R1110 N639 N765 {rNbsi}
R1111 N639 N638 {rNbsi}
R1112 N765 N764 {rNbsi}
R1113 N639 N765 {rNbsi}
R1114 N640 N766 {rNbsi}
R1115 N640 N639 {rNbsi}
R1116 N766 N765 {rNbsi}
R1117 N477 N638 {rNbsi}
R1118 N478 N639 {rNbsi}
R1119 N478 N477 {rNbsi}
R1120 N639 N638 {rNbsi}
R1121 N478 N639 {rNbsi}
R1122 N479 N640 {rNbsi}
R1123 N479 N478 {rNbsi}
R1124 N640 N639 {rNbsi}
R1125 N302 N479 {rNbsi}
R1126 N303 N480 {rNbsi}
R1127 N303 N302 {rNbsi}
R1128 N480 N479 {rNbsi}
R1129 N303 N480 {rNbsi}
R1130 N304 N481 {rNbsi}
R1131 N304 N303 {rNbsi}
R1132 N481 N480 {rNbsi}
R1133 N159 N302 {rNbsi}
R1134 N160 N303 {rNbsi}
R1135 N160 N159 {rNbsi}
R1136 N303 N302 {rNbsi}
R1137 N160 N303 {rNbsi}
R1138 N161 N304 {rNbsi}
R1139 N161 N160 {rNbsi}
R1140 N304 N303 {rNbsi}
R1141 N640 N766 {rNbsi}
R1142 N641 N767 {rNbsi}
R1143 N641 N640 {rNbsi}
R1144 N767 N766 {rNbsi}
R1145 N641 N767 {rNbsi}
R1146 N642 N768 {rNbsi}
R1147 N642 N641 {rNbsi}
R1148 N768 N767 {rNbsi}
R1149 N479 N640 {rNbsi}
R1150 N480 N641 {rNbsi}
R1151 N480 N479 {rNbsi}
R1152 N641 N640 {rNbsi}
R1153 N480 N641 {rNbsi}
R1154 N481 N642 {rNbsi}
R1155 N481 N480 {rNbsi}
R1156 N642 N641 {rNbsi}
R1157 N304 N481 {rNbsi}
R1158 N305 N482 {rNbsi}
R1159 N305 N304 {rNbsi}
R1160 N482 N481 {rNbsi}
R1161 N305 N482 {rNbsi}
R1162 N306 N483 {rNbsi}
R1163 N306 N305 {rNbsi}
R1164 N483 N482 {rNbsi}
R1165 N161 N304 {rNbsi}
R1166 N162 N305 {rNbsi}
R1167 N162 N161 {rNbsi}
R1168 N305 N304 {rNbsi}
R1169 N162 N305 {rNbsi}
R1170 N163 N306 {rNbsi}
R1171 N163 N162 {rNbsi}
R1172 N306 N305 {rNbsi}
R1173 N642 N768 {rNbsi}
R1174 N643 N769 {rNbsi}
R1175 N643 N642 {rNbsi}
R1176 N769 N768 {rNbsi}
R1177 N643 N769 {rNbsi}
R1178 N644 N770 {rNbsi}
R1179 N644 N643 {rNbsi}
R1180 N770 N769 {rNbsi}
R1181 N481 N642 {rNbsi}
R1182 N482 N643 {rNbsi}
R1183 N482 N481 {rNbsi}
R1184 N643 N642 {rNbsi}
R1185 N482 N643 {rNbsi}
R1186 N483 N644 {rNbsi}
R1187 N483 N482 {rNbsi}
R1188 N644 N643 {rNbsi}
R1189 N306 N483 {rNbsi}
R1190 N307 N484 {rNbsi}
R1191 N307 N306 {rNbsi}
R1192 N484 N483 {rNbsi}
R1193 N307 N484 {rNbsi}
R1194 N308 N485 {rNbsi}
R1195 N308 N307 {rNbsi}
R1196 N485 N484 {rNbsi}
R1197 N163 N306 {rNbsi}
R1198 N164 N307 {rNbsi}
R1199 N164 N163 {rNbsi}
R1200 N307 N306 {rNbsi}
R1201 N164 N307 {rNbsi}
R1202 N165 N308 {rNbsi}
R1203 N165 N164 {rNbsi}
R1204 N308 N307 {rNbsi}
R1205 N644 N770 {rNbsi}
R1206 N645 N771 {rNbsi}
R1207 N645 N644 {rNbsi}
R1208 N771 N770 {rNbsi}
R1209 N645 N771 {rNbsi}
R1210 N646 N772 {rNbsi}
R1211 N646 N645 {rNbsi}
R1212 N772 N771 {rNbsi}
R1213 N483 N644 {rNbsi}
R1214 N484 N645 {rNbsi}
R1215 N484 N483 {rNbsi}
R1216 N645 N644 {rNbsi}
R1217 N484 N645 {rNbsi}
R1218 N485 N646 {rNbsi}
R1219 N485 N484 {rNbsi}
R1220 N646 N645 {rNbsi}
R1221 N308 N485 {rNbsi}
R1222 N309 N486 {rNbsi}
R1223 N309 N308 {rNbsi}
R1224 N486 N485 {rNbsi}
R1225 N309 N486 {rNbsi}
R1226 N310 N487 {rNbsi}
R1227 N310 N309 {rNbsi}
R1228 N487 N486 {rNbsi}
R1229 N165 N308 {rNbsi}
R1230 N166 N309 {rNbsi}
R1231 N166 N165 {rNbsi}
R1232 N309 N308 {rNbsi}
R1233 N166 N309 {rNbsi}
R1234 N167 N310 {rNbsi}
R1235 N167 N166 {rNbsi}
R1236 N310 N309 {rNbsi}
R1237 N646 N772 {rNbsi}
R1238 N647 N773 {rNbsi}
R1239 N647 N646 {rNbsi}
R1240 N773 N772 {rNbsi}
R1241 N647 N773 {rNbsi}
R1242 N648 N774 {rNbsi}
R1243 N648 N647 {rNbsi}
R1244 N774 N773 {rNbsi}
R1245 N485 N646 {rNbsi}
R1246 N486 N647 {rNbsi}
R1247 N486 N485 {rNbsi}
R1248 N647 N646 {rNbsi}
R1249 N486 N647 {rNbsi}
R1250 N487 N648 {rNbsi}
R1251 N487 N486 {rNbsi}
R1252 N648 N647 {rNbsi}
R1253 N310 N487 {rNbsi}
R1254 N311 N488 {rNbsi}
R1255 N311 N310 {rNbsi}
R1256 N488 N487 {rNbsi}
R1257 N311 N488 {rNbsi}
R1258 N312 N489 {rNbsi}
R1259 N312 N311 {rNbsi}
R1260 N489 N488 {rNbsi}
R1261 N167 N310 {rNbsi}
R1262 N168 N311 {rNbsi}
R1263 N168 N167 {rNbsi}
R1264 N311 N310 {rNbsi}
R1265 N168 N311 {rNbsi}
R1266 N072 N312 {rNbsi}
R1267 N072 N168 {rNbsi}
R1268 N312 N311 {rNbsi}
R1269 N648 N774 {rNbsi}
R1270 N649 N775 {rNbsi}
R1271 N649 N648 {rNbsi}
R1272 N775 N774 {rNbsi}
R1273 N649 N775 {rNbsi}
R1274 0 0 {rNbsi}
R1275 0 N649 {rNbsi}
R1276 0 N775 {rNbsi}
R1277 N487 N648 {rNbsi}
R1278 N488 N649 {rNbsi}
R1279 N488 N487 {rNbsi}
R1280 N649 N648 {rNbsi}
R1281 N488 N649 {rNbsi}
R1282 N489 0 {rNbsi}
R1283 N489 N488 {rNbsi}
R1284 0 N649 {rNbsi}
R1285 N072 N312 {rNbsi}
R1286 N073 N313 {rNbsi}
R1287 N073 N072 {rNbsi}
R1288 N313 N312 {rNbsi}
R1289 N073 N313 {rNbsi}
R1290 N074 N314 {rNbsi}
R1291 N074 N073 {rNbsi}
R1292 N314 N313 {rNbsi}
R1293 N021 N072 {rNbsi}
R1294 N022 N073 {rNbsi}
R1295 N022 N021 {rNbsi}
R1296 N073 N072 {rNbsi}
R1297 N022 N073 {rNbsi}
R1298 N023 N074 {rNbsi}
R1299 N023 N022 {rNbsi}
R1300 N074 N073 {rNbsi}
R1301 N489 0 {rNbsi}
R1302 N490 0 {rNbsi}
R1303 N490 N489 {rNbsi}
R1304 0 0 {rNbsi}
R1305 N490 0 {rNbsi}
R1306 N491 0 {rNbsi}
R1307 N491 N490 {rNbsi}
R1308 0 0 {rNbsi}
R1309 N312 N489 {rNbsi}
R1310 N313 N490 {rNbsi}
R1311 N313 N312 {rNbsi}
R1312 N490 N489 {rNbsi}
R1313 N313 N490 {rNbsi}
R1314 N314 N491 {rNbsi}
R1315 N314 N313 {rNbsi}
R1316 N491 N490 {rNbsi}
R1317 N074 N314 {rNbsi}
R1318 N075 N315 {rNbsi}
R1319 N075 N074 {rNbsi}
R1320 N315 N314 {rNbsi}
R1321 N075 N315 {rNbsi}
R1322 N076 N316 {rNbsi}
R1323 N076 N075 {rNbsi}
R1324 N316 N315 {rNbsi}
R1325 N023 N074 {rNbsi}
R1326 N024 N075 {rNbsi}
R1327 N024 N023 {rNbsi}
R1328 N075 N074 {rNbsi}
R1329 N024 N075 {rNbsi}
R1330 N025 N076 {rNbsi}
R1331 N025 N024 {rNbsi}
R1332 N076 N075 {rNbsi}
R1333 N491 0 {rNbsi}
R1334 N492 0 {rNbsi}
R1335 N492 N491 {rNbsi}
R1336 0 0 {rNbsi}
R1337 N492 0 {rNbsi}
R1338 N493 0 {rNbsi}
R1339 N493 N492 {rNbsi}
R1340 0 0 {rNbsi}
R1341 N314 N491 {rNbsi}
R1342 N315 N492 {rNbsi}
R1343 N315 N314 {rNbsi}
R1344 N492 N491 {rNbsi}
R1345 N315 N492 {rNbsi}
R1346 N316 N493 {rNbsi}
R1347 N316 N315 {rNbsi}
R1348 N493 N492 {rNbsi}
R1349 N076 N316 {rNbsi}
R1350 N077 N317 {rNbsi}
R1351 N077 N076 {rNbsi}
R1352 N317 N316 {rNbsi}
R1353 N077 N317 {rNbsi}
R1354 N078 N318 {rNbsi}
R1355 N078 N077 {rNbsi}
R1356 N318 N317 {rNbsi}
R1357 N025 N076 {rNbsi}
R1358 N026 N077 {rNbsi}
R1359 N026 N025 {rNbsi}
R1360 N077 N076 {rNbsi}
R1361 N026 N077 {rNbsi}
R1362 N027 N078 {rNbsi}
R1363 N027 N026 {rNbsi}
R1364 N078 N077 {rNbsi}
R1365 N493 0 {rNbsi}
R1366 N494 0 {rNbsi}
R1367 N494 N493 {rNbsi}
R1368 0 0 {rNbsi}
R1369 N494 0 {rNbsi}
R1370 N495 0 {rNbsi}
R1371 N495 N494 {rNbsi}
R1372 0 0 {rNbsi}
R1373 N316 N493 {rNbsi}
R1374 N317 N494 {rNbsi}
R1375 N317 N316 {rNbsi}
R1376 N494 N493 {rNbsi}
R1377 N317 N494 {rNbsi}
R1378 N318 N495 {rNbsi}
R1379 N318 N317 {rNbsi}
R1380 N495 N494 {rNbsi}
R1381 N078 N318 {rNbsi}
R1382 N079 N319 {rNbsi}
R1383 N079 N078 {rNbsi}
R1384 N319 N318 {rNbsi}
R1385 N079 N319 {rNbsi}
R1386 N080 N320 {rNbsi}
R1387 N080 N079 {rNbsi}
R1388 N320 N319 {rNbsi}
R1389 N027 N078 {rNbsi}
R1390 N028 N079 {rNbsi}
R1391 N028 N027 {rNbsi}
R1392 N079 N078 {rNbsi}
R1393 N028 N079 {rNbsi}
R1394 N029 N080 {rNbsi}
R1395 N029 N028 {rNbsi}
R1396 N080 N079 {rNbsi}
R1397 N495 0 {rNbsi}
R1398 N496 0 {rNbsi}
R1399 N496 N495 {rNbsi}
R1400 0 0 {rNbsi}
R1401 N496 0 {rNbsi}
R1402 N497 0 {rNbsi}
R1403 N497 N496 {rNbsi}
R1404 0 0 {rNbsi}
R1405 N318 N495 {rNbsi}
R1406 N319 N496 {rNbsi}
R1407 N319 N318 {rNbsi}
R1408 N496 N495 {rNbsi}
R1409 N319 N496 {rNbsi}
R1410 N320 N497 {rNbsi}
R1411 N320 N319 {rNbsi}
R1412 N497 N496 {rNbsi}
R1413 N080 N320 {rNbsi}
R1414 N081 N321 {rNbsi}
R1415 N081 N080 {rNbsi}
R1416 N321 N320 {rNbsi}
R1417 N081 N321 {rNbsi}
R1418 N082 N322 {rNbsi}
R1419 N082 N081 {rNbsi}
R1420 N322 N321 {rNbsi}
R1421 N029 N080 {rNbsi}
R1422 N030 N081 {rNbsi}
R1423 N030 N029 {rNbsi}
R1424 N081 N080 {rNbsi}
R1425 N030 N081 {rNbsi}
R1426 N031 N082 {rNbsi}
R1427 N031 N030 {rNbsi}
R1428 N082 N081 {rNbsi}
R1429 N497 0 {rNbsi}
R1430 N498 0 {rNbsi}
R1431 N498 N497 {rNbsi}
R1432 0 0 {rNbsi}
R1433 N498 0 {rNbsi}
R1434 N499 0 {rNbsi}
R1435 N499 N498 {rNbsi}
R1436 0 0 {rNbsi}
R1437 N320 N497 {rNbsi}
R1438 N321 N498 {rNbsi}
R1439 N321 N320 {rNbsi}
R1440 N498 N497 {rNbsi}
R1441 N321 N498 {rNbsi}
R1442 N322 N499 {rNbsi}
R1443 N322 N321 {rNbsi}
R1444 N499 N498 {rNbsi}
R1445 N082 N322 {rNbsi}
R1446 N083 N323 {rNbsi}
R1447 N083 N082 {rNbsi}
R1448 N323 N322 {rNbsi}
R1449 N083 N323 {rNbsi}
R1450 N084 N324 {rNbsi}
R1451 N084 N083 {rNbsi}
R1452 N324 N323 {rNbsi}
R1453 N031 N082 {rNbsi}
R1454 N032 N083 {rNbsi}
R1455 N032 N031 {rNbsi}
R1456 N083 N082 {rNbsi}
R1457 N032 N083 {rNbsi}
R1458 N033 N084 {rNbsi}
R1459 N033 N032 {rNbsi}
R1460 N084 N083 {rNbsi}
R1461 N499 0 {rNbsi}
R1462 N500 0 {rNbsi}
R1463 N500 N499 {rNbsi}
R1464 0 0 {rNbsi}
R1465 N500 0 {rNbsi}
R1466 N501 0 {rNbsi}
R1467 N501 N500 {rNbsi}
R1468 0 0 {rNbsi}
R1469 N322 N499 {rNbsi}
R1470 N323 N500 {rNbsi}
R1471 N323 N322 {rNbsi}
R1472 N500 N499 {rNbsi}
R1473 N323 N500 {rNbsi}
R1474 N324 N501 {rNbsi}
R1475 N324 N323 {rNbsi}
R1476 N501 N500 {rNbsi}
R1477 N084 N324 {rNbsi}
R1478 N085 N325 {rNbsi}
R1479 N085 N084 {rNbsi}
R1480 N325 N324 {rNbsi}
R1481 N085 N325 {rNbsi}
R1482 N086 N326 {rNbsi}
R1483 N086 N085 {rNbsi}
R1484 N326 N325 {rNbsi}
R1485 N033 N084 {rNbsi}
R1486 N034 N085 {rNbsi}
R1487 N034 N033 {rNbsi}
R1488 N085 N084 {rNbsi}
R1489 N034 N085 {rNbsi}
R1490 N035 N086 {rNbsi}
R1491 N035 N034 {rNbsi}
R1492 N086 N085 {rNbsi}
R1493 N501 0 {rNbsi}
R1494 N502 0 {rNbsi}
R1495 N502 N501 {rNbsi}
R1496 0 0 {rNbsi}
R1497 N502 0 {rNbsi}
R1498 N503 0 {rNbsi}
R1499 N503 N502 {rNbsi}
R1500 0 0 {rNbsi}
R1501 N324 N501 {rNbsi}
R1502 N325 N502 {rNbsi}
R1503 N325 N324 {rNbsi}
R1504 N502 N501 {rNbsi}
R1505 N325 N502 {rNbsi}
R1506 N326 N503 {rNbsi}
R1507 N326 N325 {rNbsi}
R1508 N503 N502 {rNbsi}
R1509 N086 N326 {rNbsi}
R1510 N087 N327 {rNbsi}
R1511 N087 N086 {rNbsi}
R1512 N327 N326 {rNbsi}
R1513 N087 N327 {rNbsi}
R1514 N088 N328 {rNbsi}
R1515 N088 N087 {rNbsi}
R1516 N328 N327 {rNbsi}
R1517 N035 N086 {rNbsi}
R1518 N036 N087 {rNbsi}
R1519 N036 N035 {rNbsi}
R1520 N087 N086 {rNbsi}
R1521 N036 N087 {rNbsi}
R1522 N037 N088 {rNbsi}
R1523 N037 N036 {rNbsi}
R1524 N088 N087 {rNbsi}
R1525 N503 0 {rNbsi}
R1526 N504 0 {rNbsi}
R1527 N504 N503 {rNbsi}
R1528 0 0 {rNbsi}
R1529 N504 0 {rNbsi}
R1530 N505 0 {rNbsi}
R1531 N505 N504 {rNbsi}
R1532 0 0 {rNbsi}
R1533 N326 N503 {rNbsi}
R1534 N327 N504 {rNbsi}
R1535 N327 N326 {rNbsi}
R1536 N504 N503 {rNbsi}
R1537 N327 N504 {rNbsi}
R1538 N328 N505 {rNbsi}
R1539 N328 N327 {rNbsi}
R1540 N505 N504 {rNbsi}
R1541 N328 N505 {rNbsi}
R1542 N329 N506 {rNbsi}
R1543 N329 N328 {rNbsi}
R1544 N506 N505 {rNbsi}
R1545 N329 N506 {rNbsi}
R1546 N330 N507 {rNbsi}
R1547 N330 N329 {rNbsi}
R1548 N507 N506 {rNbsi}
R1549 N088 N328 {rNbsi}
R1550 N169 N329 {rNbsi}
R1551 N169 N088 {rNbsi}
R1552 N329 N328 {rNbsi}
R1553 N169 N329 {rNbsi}
R1554 N170 N330 {rNbsi}
R1555 N170 N169 {rNbsi}
R1556 N330 N329 {rNbsi}
R1557 0 0 {rNbsi}
R1558 N650 N776 {rNbsi}
R1559 N650 0 {rNbsi}
R1560 N776 0 {rNbsi}
R1561 N650 N776 {rNbsi}
R1562 N651 N777 {rNbsi}
R1563 N651 N650 {rNbsi}
R1564 N777 N776 {rNbsi}
R1565 N505 0 {rNbsi}
R1566 N506 N650 {rNbsi}
R1567 N506 N505 {rNbsi}
R1568 N650 0 {rNbsi}
R1569 N506 N650 {rNbsi}
R1570 N507 N651 {rNbsi}
R1571 N507 N506 {rNbsi}
R1572 N651 N650 {rNbsi}
R1573 N330 N507 {rNbsi}
R1574 N331 N508 {rNbsi}
R1575 N331 N330 {rNbsi}
R1576 N508 N507 {rNbsi}
R1577 N331 N508 {rNbsi}
R1578 N332 N509 {rNbsi}
R1579 N332 N331 {rNbsi}
R1580 N509 N508 {rNbsi}
R1581 N170 N330 {rNbsi}
R1582 N171 N331 {rNbsi}
R1583 N171 N170 {rNbsi}
R1584 N331 N330 {rNbsi}
R1585 N171 N331 {rNbsi}
R1586 N172 N332 {rNbsi}
R1587 N172 N171 {rNbsi}
R1588 N332 N331 {rNbsi}
R1589 N651 N777 {rNbsi}
R1590 N652 N778 {rNbsi}
R1591 N652 N651 {rNbsi}
R1592 N778 N777 {rNbsi}
R1593 N652 N778 {rNbsi}
R1594 N653 N779 {rNbsi}
R1595 N653 N652 {rNbsi}
R1596 N779 N778 {rNbsi}
R1597 N507 N651 {rNbsi}
R1598 N508 N652 {rNbsi}
R1599 N508 N507 {rNbsi}
R1600 N652 N651 {rNbsi}
R1601 N508 N652 {rNbsi}
R1602 N509 N653 {rNbsi}
R1603 N509 N508 {rNbsi}
R1604 N653 N652 {rNbsi}
R1605 N332 N509 {rNbsi}
R1606 N333 N510 {rNbsi}
R1607 N333 N332 {rNbsi}
R1608 N510 N509 {rNbsi}
R1609 N333 N510 {rNbsi}
R1610 N334 N511 {rNbsi}
R1611 N334 N333 {rNbsi}
R1612 N511 N510 {rNbsi}
R1613 N172 N332 {rNbsi}
R1614 N173 N333 {rNbsi}
R1615 N173 N172 {rNbsi}
R1616 N333 N332 {rNbsi}
R1617 N173 N333 {rNbsi}
R1618 N174 N334 {rNbsi}
R1619 N174 N173 {rNbsi}
R1620 N334 N333 {rNbsi}
R1621 N653 N779 {rNbsi}
R1622 N654 N780 {rNbsi}
R1623 N654 N653 {rNbsi}
R1624 N780 N779 {rNbsi}
R1625 N654 N780 {rNbsi}
R1626 N655 N781 {rNbsi}
R1627 N655 N654 {rNbsi}
R1628 N781 N780 {rNbsi}
R1629 N509 N653 {rNbsi}
R1630 N510 N654 {rNbsi}
R1631 N510 N509 {rNbsi}
R1632 N654 N653 {rNbsi}
R1633 N510 N654 {rNbsi}
R1634 N511 N655 {rNbsi}
R1635 N511 N510 {rNbsi}
R1636 N655 N654 {rNbsi}
R1637 N334 N511 {rNbsi}
R1638 N335 N512 {rNbsi}
R1639 N335 N334 {rNbsi}
R1640 N512 N511 {rNbsi}
R1641 N335 N512 {rNbsi}
R1642 N336 N513 {rNbsi}
R1643 N336 N335 {rNbsi}
R1644 N513 N512 {rNbsi}
R1645 N174 N334 {rNbsi}
R1646 N175 N335 {rNbsi}
R1647 N175 N174 {rNbsi}
R1648 N335 N334 {rNbsi}
R1649 N175 N335 {rNbsi}
R1650 N176 N336 {rNbsi}
R1651 N176 N175 {rNbsi}
R1652 N336 N335 {rNbsi}
R1653 N655 N781 {rNbsi}
R1654 N656 N782 {rNbsi}
R1655 N656 N655 {rNbsi}
R1656 N782 N781 {rNbsi}
R1657 N656 N782 {rNbsi}
R1658 N657 N783 {rNbsi}
R1659 N657 N656 {rNbsi}
R1660 N783 N782 {rNbsi}
R1661 N511 N655 {rNbsi}
R1662 N512 N656 {rNbsi}
R1663 N512 N511 {rNbsi}
R1664 N656 N655 {rNbsi}
R1665 N512 N656 {rNbsi}
R1666 N513 N657 {rNbsi}
R1667 N513 N512 {rNbsi}
R1668 N657 N656 {rNbsi}
R1669 N336 N513 {rNbsi}
R1670 N337 N514 {rNbsi}
R1671 N337 N336 {rNbsi}
R1672 N514 N513 {rNbsi}
R1673 N337 N514 {rNbsi}
R1674 N338 N515 {rNbsi}
R1675 N338 N337 {rNbsi}
R1676 N515 N514 {rNbsi}
R1677 N176 N336 {rNbsi}
R1678 N177 N337 {rNbsi}
R1679 N177 N176 {rNbsi}
R1680 N337 N336 {rNbsi}
R1681 N177 N337 {rNbsi}
R1682 N178 N338 {rNbsi}
R1683 N178 N177 {rNbsi}
R1684 N338 N337 {rNbsi}
R1685 N657 N783 {rNbsi}
R1686 N658 N784 {rNbsi}
R1687 N658 N657 {rNbsi}
R1688 N784 N783 {rNbsi}
R1689 N658 N784 {rNbsi}
R1690 N659 N785 {rNbsi}
R1691 N659 N658 {rNbsi}
R1692 N785 N784 {rNbsi}
R1693 N513 N657 {rNbsi}
R1694 N514 N658 {rNbsi}
R1695 N514 N513 {rNbsi}
R1696 N658 N657 {rNbsi}
R1697 N514 N658 {rNbsi}
R1698 N515 N659 {rNbsi}
R1699 N515 N514 {rNbsi}
R1700 N659 N658 {rNbsi}
R1701 N338 N515 {rNbsi}
R1702 N339 N516 {rNbsi}
R1703 N339 N338 {rNbsi}
R1704 N516 N515 {rNbsi}
R1705 N339 N516 {rNbsi}
R1706 N340 N517 {rNbsi}
R1707 N340 N339 {rNbsi}
R1708 N517 N516 {rNbsi}
R1709 N178 N338 {rNbsi}
R1710 N179 N339 {rNbsi}
R1711 N179 N178 {rNbsi}
R1712 N339 N338 {rNbsi}
R1713 N179 N339 {rNbsi}
R1714 N180 N340 {rNbsi}
R1715 N180 N179 {rNbsi}
R1716 N340 N339 {rNbsi}
R1717 N659 N785 {rNbsi}
R1718 N660 N786 {rNbsi}
R1719 N660 N659 {rNbsi}
R1720 N786 N785 {rNbsi}
R1721 N660 N786 {rNbsi}
R1722 N661 N787 {rNbsi}
R1723 N661 N660 {rNbsi}
R1724 N787 N786 {rNbsi}
R1725 N515 N659 {rNbsi}
R1726 N516 N660 {rNbsi}
R1727 N516 N515 {rNbsi}
R1728 N660 N659 {rNbsi}
R1729 N516 N660 {rNbsi}
R1730 N517 N661 {rNbsi}
R1731 N517 N516 {rNbsi}
R1732 N661 N660 {rNbsi}
R1733 N340 N517 {rNbsi}
R1734 N341 N518 {rNbsi}
R1735 N341 N340 {rNbsi}
R1736 N518 N517 {rNbsi}
R1737 N341 N518 {rNbsi}
R1738 N342 N519 {rNbsi}
R1739 N342 N341 {rNbsi}
R1740 N519 N518 {rNbsi}
R1741 N180 N340 {rNbsi}
R1742 N181 N341 {rNbsi}
R1743 N181 N180 {rNbsi}
R1744 N341 N340 {rNbsi}
R1745 N181 N341 {rNbsi}
R1746 N182 N342 {rNbsi}
R1747 N182 N181 {rNbsi}
R1748 N342 N341 {rNbsi}
R1749 N661 N787 {rNbsi}
R1750 N662 N788 {rNbsi}
R1751 N662 N661 {rNbsi}
R1752 N788 N787 {rNbsi}
R1753 N662 N788 {rNbsi}
R1754 N663 N789 {rNbsi}
R1755 N663 N662 {rNbsi}
R1756 N789 N788 {rNbsi}
R1757 N517 N661 {rNbsi}
R1758 N518 N662 {rNbsi}
R1759 N518 N517 {rNbsi}
R1760 N662 N661 {rNbsi}
R1761 N518 N662 {rNbsi}
R1762 N519 N663 {rNbsi}
R1763 N519 N518 {rNbsi}
R1764 N663 N662 {rNbsi}
R1765 N342 N519 {rNbsi}
R1766 N343 N520 {rNbsi}
R1767 N343 N342 {rNbsi}
R1768 N520 N519 {rNbsi}
R1769 N343 N520 {rNbsi}
R1770 N344 N521 {rNbsi}
R1771 N344 N343 {rNbsi}
R1772 N521 N520 {rNbsi}
R1773 N182 N342 {rNbsi}
R1774 N183 N343 {rNbsi}
R1775 N183 N182 {rNbsi}
R1776 N343 N342 {rNbsi}
R1777 N183 N343 {rNbsi}
R1778 N184 N344 {rNbsi}
R1779 N184 N183 {rNbsi}
R1780 N344 N343 {rNbsi}
R1781 N663 N789 {rNbsi}
R1782 N664 N790 {rNbsi}
R1783 N664 N663 {rNbsi}
R1784 N790 N789 {rNbsi}
R1785 N664 N790 {rNbsi}
R1786 N665 N791 {rNbsi}
R1787 N665 N664 {rNbsi}
R1788 N791 N790 {rNbsi}
R1789 N519 N663 {rNbsi}
R1790 N520 N664 {rNbsi}
R1791 N520 N519 {rNbsi}
R1792 N664 N663 {rNbsi}
R1793 N520 N664 {rNbsi}
R1794 N521 N665 {rNbsi}
R1795 N521 N520 {rNbsi}
R1796 N665 N664 {rNbsi}
R1797 N344 N521 {rNbsi}
R1798 N345 N522 {rNbsi}
R1799 N345 N344 {rNbsi}
R1800 N522 N521 {rNbsi}
R1801 N345 N522 {rNbsi}
R1802 N346 N523 {rNbsi}
R1803 N346 N345 {rNbsi}
R1804 N523 N522 {rNbsi}
R1805 N184 N344 {rNbsi}
R1806 N185 N345 {rNbsi}
R1807 N185 N184 {rNbsi}
R1808 N345 N344 {rNbsi}
R1809 N185 N345 {rNbsi}
R1810 N186 N346 {rNbsi}
R1811 N186 N185 {rNbsi}
R1812 N346 N345 {rNbsi}
R1813 N665 N791 {rNbsi}
R1814 N666 N792 {rNbsi}
R1815 N666 N665 {rNbsi}
R1816 N792 N791 {rNbsi}
R1817 N666 N792 {rNbsi}
R1818 N667 N793 {rNbsi}
R1819 N667 N666 {rNbsi}
R1820 N793 N792 {rNbsi}
R1821 N521 N665 {rNbsi}
R1822 N522 N666 {rNbsi}
R1823 N522 N521 {rNbsi}
R1824 N666 N665 {rNbsi}
R1825 N522 N666 {rNbsi}
R1826 N523 N667 {rNbsi}
R1827 N523 N522 {rNbsi}
R1828 N667 N666 {rNbsi}
R1829 N346 N523 {rNbsi}
R1830 N347 N524 {rNbsi}
R1831 N347 N346 {rNbsi}
R1832 N524 N523 {rNbsi}
R1833 N347 N524 {rNbsi}
R1834 N348 N525 {rNbsi}
R1835 N348 N347 {rNbsi}
R1836 N525 N524 {rNbsi}
R1837 N186 N346 {rNbsi}
R1838 N187 N347 {rNbsi}
R1839 N187 N186 {rNbsi}
R1840 N347 N346 {rNbsi}
R1841 N187 N347 {rNbsi}
R1842 N188 N348 {rNbsi}
R1843 N188 N187 {rNbsi}
R1844 N348 N347 {rNbsi}
R1845 N667 N793 {rNbsi}
R1846 N668 N794 {rNbsi}
R1847 N668 N667 {rNbsi}
R1848 N794 N793 {rNbsi}
R1849 N668 N794 {rNbsi}
R1850 N669 N795 {rNbsi}
R1851 N669 N668 {rNbsi}
R1852 N795 N794 {rNbsi}
R1853 N523 N667 {rNbsi}
R1854 N524 N668 {rNbsi}
R1855 N524 N523 {rNbsi}
R1856 N668 N667 {rNbsi}
R1857 N524 N668 {rNbsi}
R1858 N525 N669 {rNbsi}
R1859 N525 N524 {rNbsi}
R1860 N669 N668 {rNbsi}
R1861 N348 N525 {rNbsi}
R1862 N349 N526 {rNbsi}
R1863 N349 N348 {rNbsi}
R1864 N526 N525 {rNbsi}
R1865 N349 N526 {rNbsi}
R1866 N350 N527 {rNbsi}
R1867 N350 N349 {rNbsi}
R1868 N527 N526 {rNbsi}
R1869 N188 N348 {rNbsi}
R1870 N189 N349 {rNbsi}
R1871 N189 N188 {rNbsi}
R1872 N349 N348 {rNbsi}
R1873 N189 N349 {rNbsi}
R1874 N190 N350 {rNbsi}
R1875 N190 N189 {rNbsi}
R1876 N350 N349 {rNbsi}
R1877 N669 N795 {rNbsi}
R1878 N670 N796 {rNbsi}
R1879 N670 N669 {rNbsi}
R1880 N796 N795 {rNbsi}
R1881 N670 N796 {rNbsi}
R1882 N671 N797 {rNbsi}
R1883 N671 N670 {rNbsi}
R1884 N797 N796 {rNbsi}
R1885 N525 N669 {rNbsi}
R1886 N526 N670 {rNbsi}
R1887 N526 N525 {rNbsi}
R1888 N670 N669 {rNbsi}
R1889 N526 N670 {rNbsi}
R1890 N527 N671 {rNbsi}
R1891 N527 N526 {rNbsi}
R1892 N671 N670 {rNbsi}
R1893 N350 N527 {rNbsi}
R1894 N351 N528 {rNbsi}
R1895 N351 N350 {rNbsi}
R1896 N528 N527 {rNbsi}
R1897 N351 N528 {rNbsi}
R1898 N352 N529 {rNbsi}
R1899 N352 N351 {rNbsi}
R1900 N529 N528 {rNbsi}
R1901 N190 N350 {rNbsi}
R1902 N191 N351 {rNbsi}
R1903 N191 N190 {rNbsi}
R1904 N351 N350 {rNbsi}
R1905 N191 N351 {rNbsi}
R1906 N192 N352 {rNbsi}
R1907 N192 N191 {rNbsi}
R1908 N352 N351 {rNbsi}
R1909 N671 N797 {rNbsi}
R1910 N672 N798 {rNbsi}
R1911 N672 N671 {rNbsi}
R1912 N798 N797 {rNbsi}
R1913 N672 N798 {rNbsi}
R1914 N673 N799 {rNbsi}
R1915 N673 N672 {rNbsi}
R1916 N799 N798 {rNbsi}
R1917 N527 N671 {rNbsi}
R1918 N528 N672 {rNbsi}
R1919 N528 N527 {rNbsi}
R1920 N672 N671 {rNbsi}
R1921 N528 N672 {rNbsi}
R1922 N529 N673 {rNbsi}
R1923 N529 N528 {rNbsi}
R1924 N673 N672 {rNbsi}
R1925 N352 N529 {rNbsi}
R1926 N353 N530 {rNbsi}
R1927 N353 N352 {rNbsi}
R1928 N530 N529 {rNbsi}
R1929 N353 N530 {rNbsi}
R1930 N354 N531 {rNbsi}
R1931 N354 N353 {rNbsi}
R1932 N531 N530 {rNbsi}
R1933 N192 N352 {rNbsi}
R1934 N193 N353 {rNbsi}
R1935 N193 N192 {rNbsi}
R1936 N353 N352 {rNbsi}
R1937 N193 N353 {rNbsi}
R1938 N194 N354 {rNbsi}
R1939 N194 N193 {rNbsi}
R1940 N354 N353 {rNbsi}
R1941 N673 N799 {rNbsi}
R1942 N674 N800 {rNbsi}
R1943 N674 N673 {rNbsi}
R1944 N800 N799 {rNbsi}
R1945 N674 N800 {rNbsi}
R1946 N675 N801 {rNbsi}
R1947 N675 N674 {rNbsi}
R1948 N801 N800 {rNbsi}
R1949 N529 N673 {rNbsi}
R1950 N530 N674 {rNbsi}
R1951 N530 N529 {rNbsi}
R1952 N674 N673 {rNbsi}
R1953 N530 N674 {rNbsi}
R1954 N531 N675 {rNbsi}
R1955 N531 N530 {rNbsi}
R1956 N675 N674 {rNbsi}
R1957 N354 N531 {rNbsi}
R1958 N355 N532 {rNbsi}
R1959 N355 N354 {rNbsi}
R1960 N532 N531 {rNbsi}
R1961 N355 N532 {rNbsi}
R1962 N356 N533 {rNbsi}
R1963 N356 N355 {rNbsi}
R1964 N533 N532 {rNbsi}
R1965 N194 N354 {rNbsi}
R1966 N195 N355 {rNbsi}
R1967 N195 N194 {rNbsi}
R1968 N355 N354 {rNbsi}
R1969 N195 N355 {rNbsi}
R1970 N196 N356 {rNbsi}
R1971 N196 N195 {rNbsi}
R1972 N356 N355 {rNbsi}
R1973 N675 N801 {rNbsi}
R1974 N676 N802 {rNbsi}
R1975 N676 N675 {rNbsi}
R1976 N802 N801 {rNbsi}
R1977 N676 N802 {rNbsi}
R1978 N677 N803 {rNbsi}
R1979 N677 N676 {rNbsi}
R1980 N803 N802 {rNbsi}
R1981 N531 N675 {rNbsi}
R1982 N532 N676 {rNbsi}
R1983 N532 N531 {rNbsi}
R1984 N676 N675 {rNbsi}
R1985 N532 N676 {rNbsi}
R1986 N533 N677 {rNbsi}
R1987 N533 N532 {rNbsi}
R1988 N677 N676 {rNbsi}
R1989 N356 N533 {rNbsi}
R1990 N357 N534 {rNbsi}
R1991 N357 N356 {rNbsi}
R1992 N534 N533 {rNbsi}
R1993 N357 N534 {rNbsi}
R1994 N358 N535 {rNbsi}
R1995 N358 N357 {rNbsi}
R1996 N535 N534 {rNbsi}
R1997 N196 N356 {rNbsi}
R1998 N197 N357 {rNbsi}
R1999 N197 N196 {rNbsi}
R2000 N357 N356 {rNbsi}
R2001 N197 N357 {rNbsi}
R2002 N198 N358 {rNbsi}
R2003 N198 N197 {rNbsi}
R2004 N358 N357 {rNbsi}
R2005 N677 N803 {rNbsi}
R2006 N678 N804 {rNbsi}
R2007 N678 N677 {rNbsi}
R2008 N804 N803 {rNbsi}
R2009 N678 N804 {rNbsi}
R2010 N679 N805 {rNbsi}
R2011 N679 N678 {rNbsi}
R2012 N805 N804 {rNbsi}
R2013 N533 N677 {rNbsi}
R2014 N534 N678 {rNbsi}
R2015 N534 N533 {rNbsi}
R2016 N678 N677 {rNbsi}
R2017 N534 N678 {rNbsi}
R2018 N535 N679 {rNbsi}
R2019 N535 N534 {rNbsi}
R2020 N679 N678 {rNbsi}
R2021 N358 N535 {rNbsi}
R2022 N359 N536 {rNbsi}
R2023 N359 N358 {rNbsi}
R2024 N536 N535 {rNbsi}
R2025 N359 N536 {rNbsi}
R2026 N360 N537 {rNbsi}
R2027 N360 N359 {rNbsi}
R2028 N537 N536 {rNbsi}
R2029 N198 N358 {rNbsi}
R2030 N199 N359 {rNbsi}
R2031 N199 N198 {rNbsi}
R2032 N359 N358 {rNbsi}
R2033 N199 N359 {rNbsi}
R2034 N200 N360 {rNbsi}
R2035 N200 N199 {rNbsi}
R2036 N360 N359 {rNbsi}
R2037 N679 N805 {rNbsi}
R2038 N680 N806 {rNbsi}
R2039 N680 N679 {rNbsi}
R2040 N806 N805 {rNbsi}
R2041 N680 N806 {rNbsi}
R2042 N681 N807 {rNbsi}
R2043 N681 N680 {rNbsi}
R2044 N807 N806 {rNbsi}
R2045 N535 N679 {rNbsi}
R2046 N536 N680 {rNbsi}
R2047 N536 N535 {rNbsi}
R2048 N680 N679 {rNbsi}
R2049 N536 N680 {rNbsi}
R2050 N537 N681 {rNbsi}
R2051 N537 N536 {rNbsi}
R2052 N681 N680 {rNbsi}
R2053 N360 N537 {rNbsi}
R2054 N361 N538 {rNbsi}
R2055 N361 N360 {rNbsi}
R2056 N538 N537 {rNbsi}
R2057 N361 N538 {rNbsi}
R2058 N362 N539 {rNbsi}
R2059 N362 N361 {rNbsi}
R2060 N539 N538 {rNbsi}
R2061 N200 N360 {rNbsi}
R2062 N201 N361 {rNbsi}
R2063 N201 N200 {rNbsi}
R2064 N361 N360 {rNbsi}
R2065 N201 N361 {rNbsi}
R2066 N202 N362 {rNbsi}
R2067 N202 N201 {rNbsi}
R2068 N362 N361 {rNbsi}
R2069 N681 N807 {rNbsi}
R2070 N682 N808 {rNbsi}
R2071 N682 N681 {rNbsi}
R2072 N808 N807 {rNbsi}
R2073 N682 N808 {rNbsi}
R2074 N683 N809 {rNbsi}
R2075 N683 N682 {rNbsi}
R2076 N809 N808 {rNbsi}
R2077 N537 N681 {rNbsi}